# Altium project Social_Security_PRJ.PrjPcb
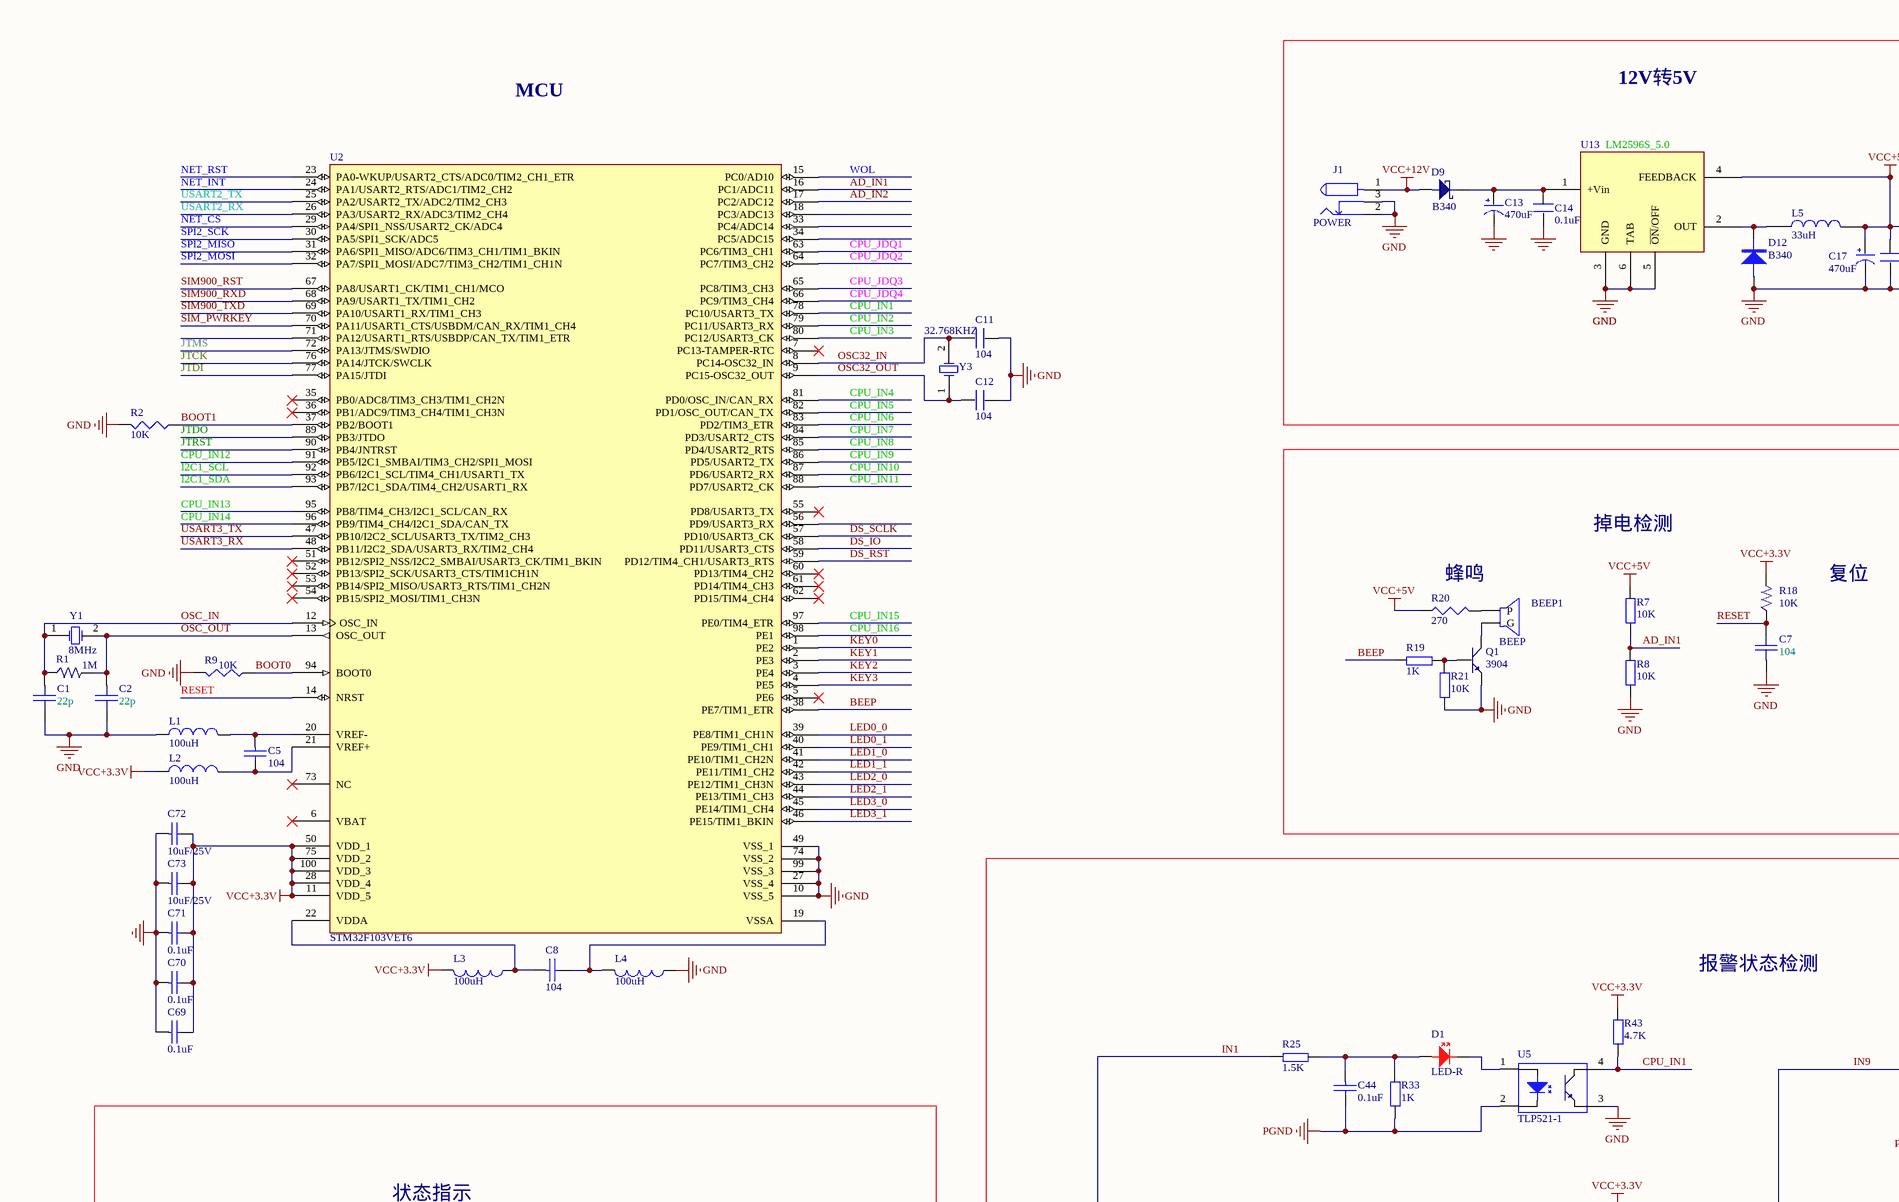
[diagram p0: Sheet1.SchDoc, top left]
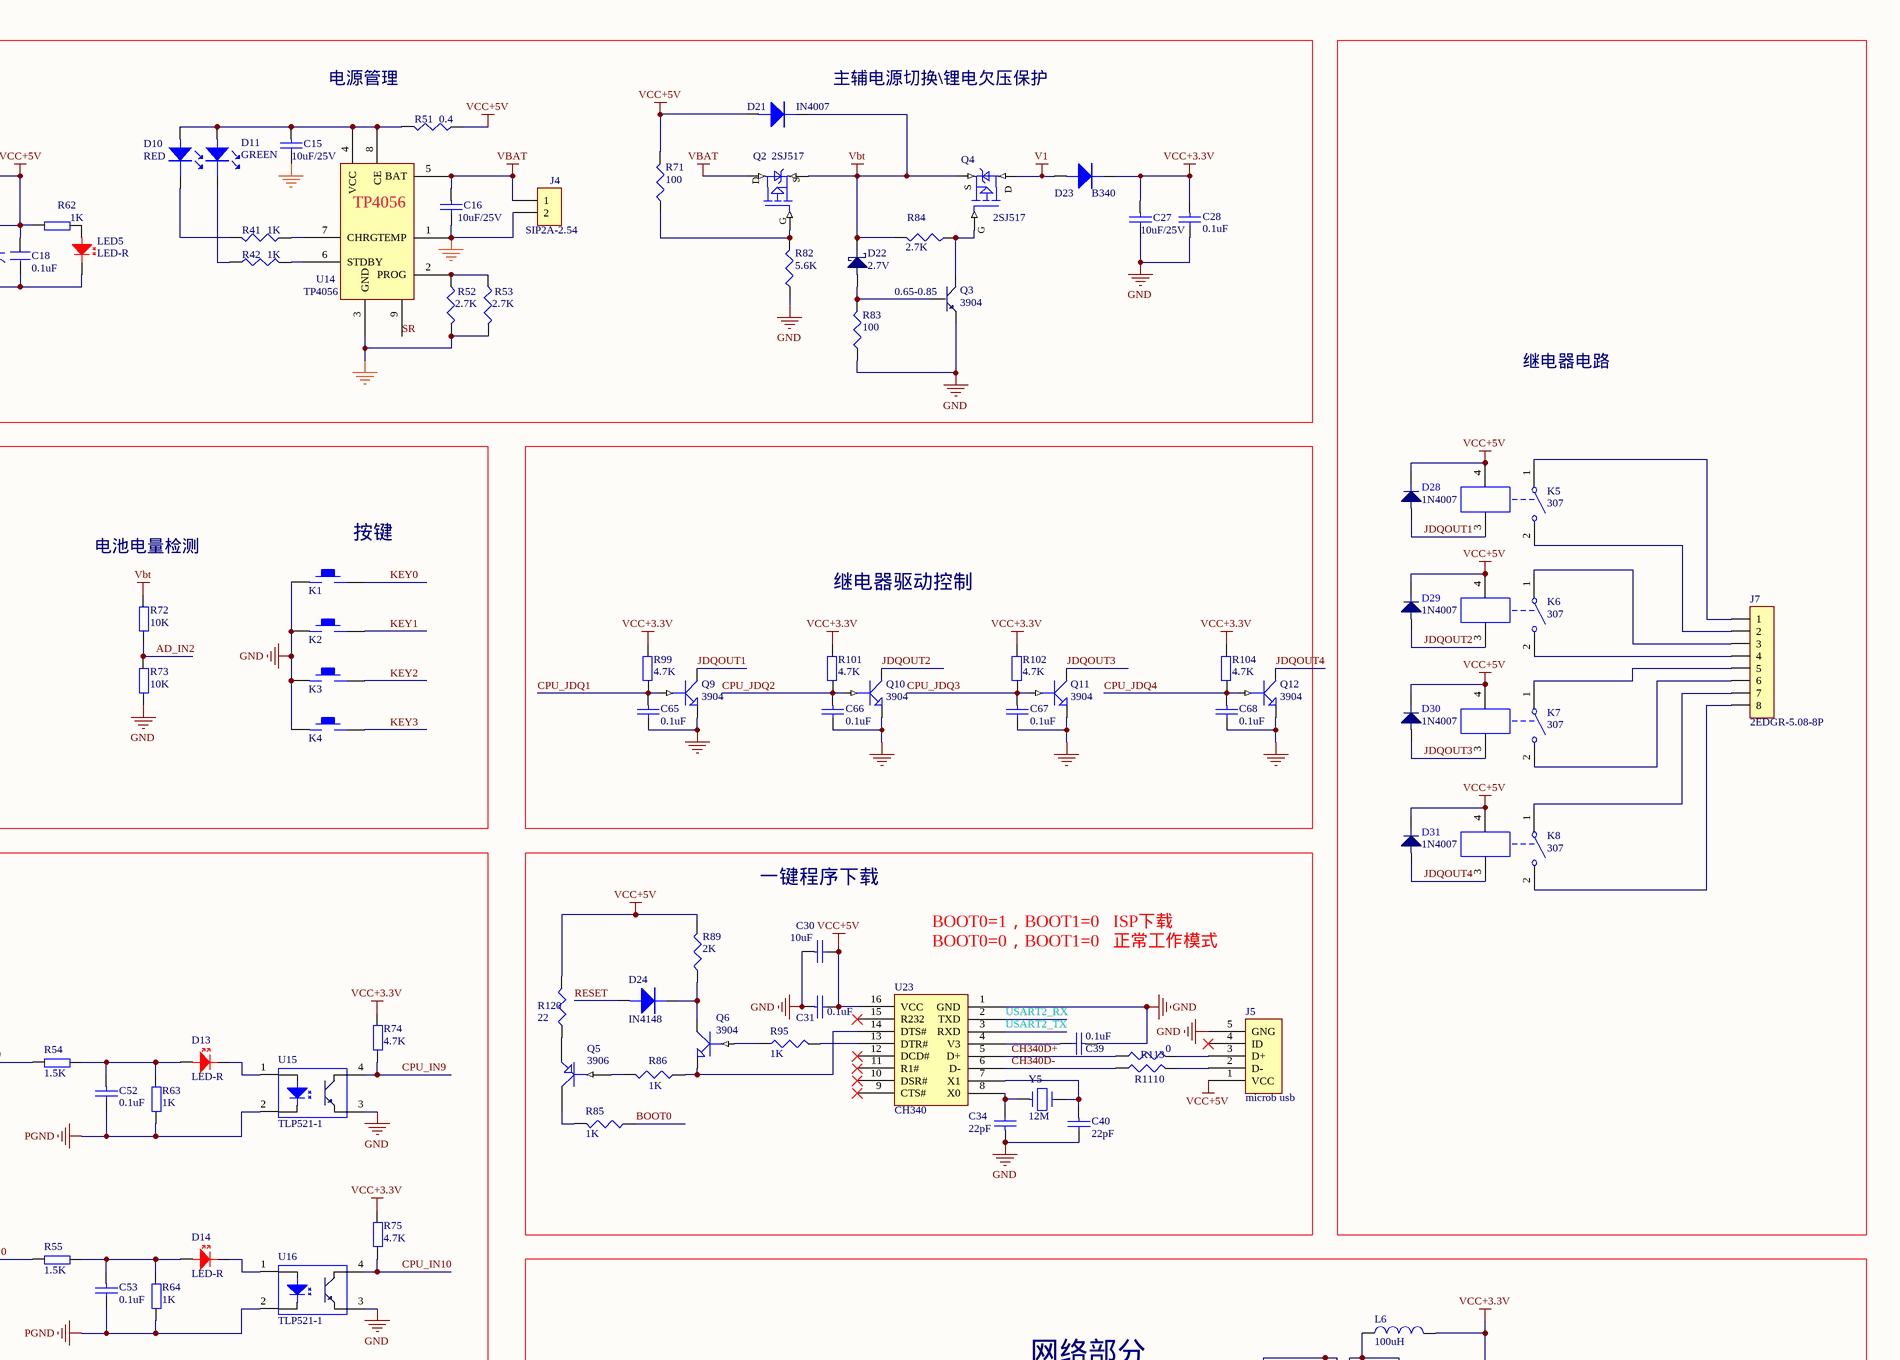
[diagram p1: Sheet1.SchDoc, top right]
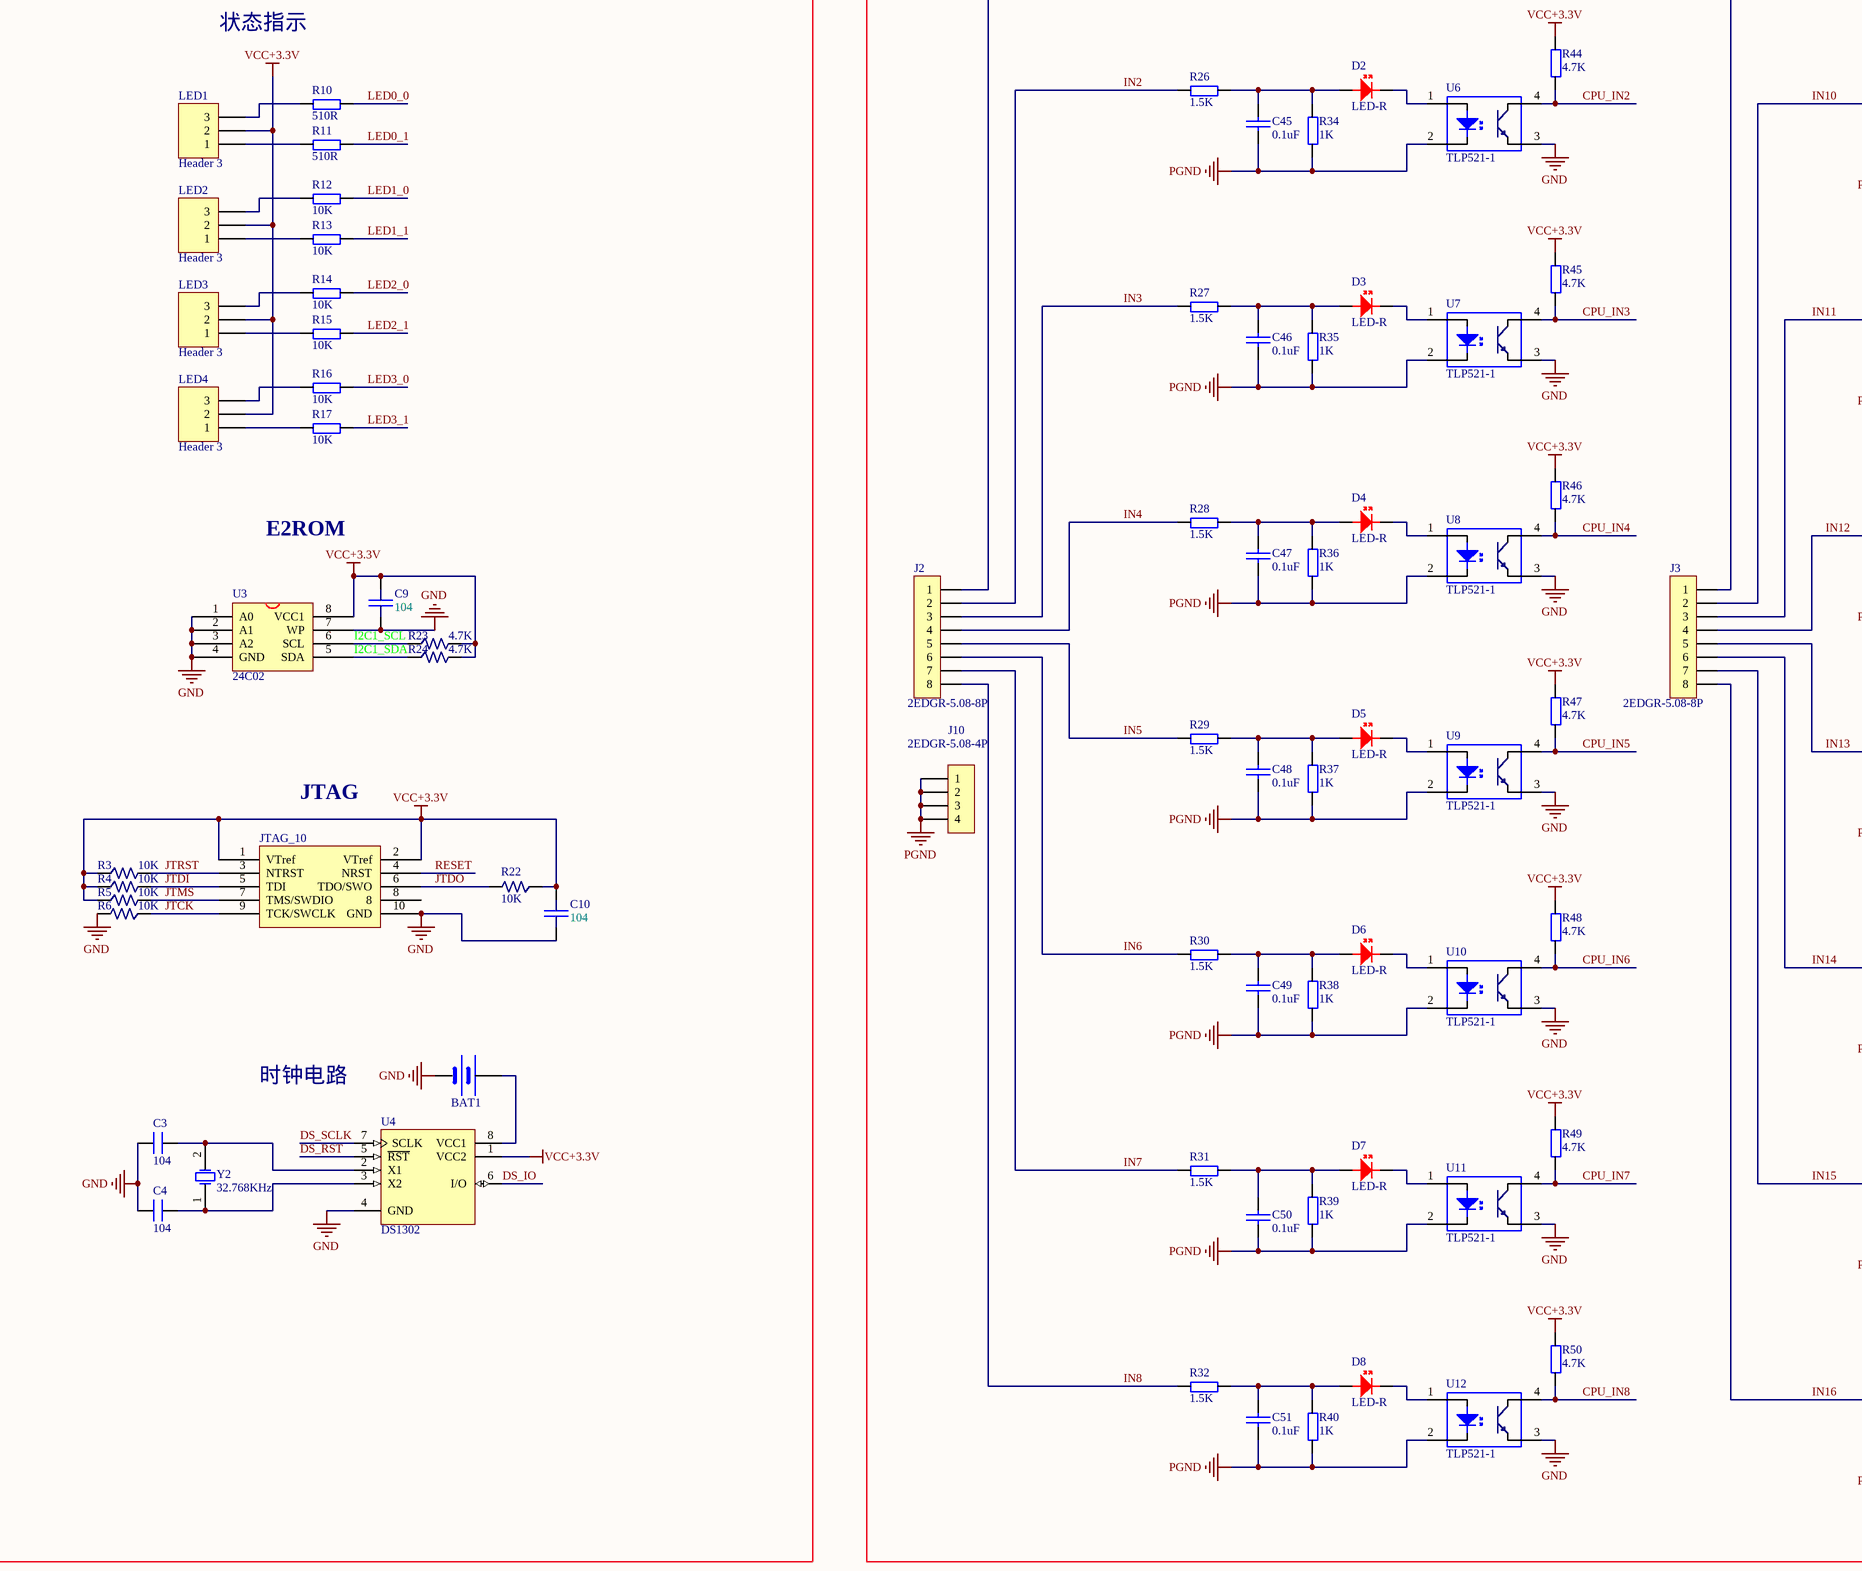
[diagram p2: Sheet1.SchDoc, bottom left]
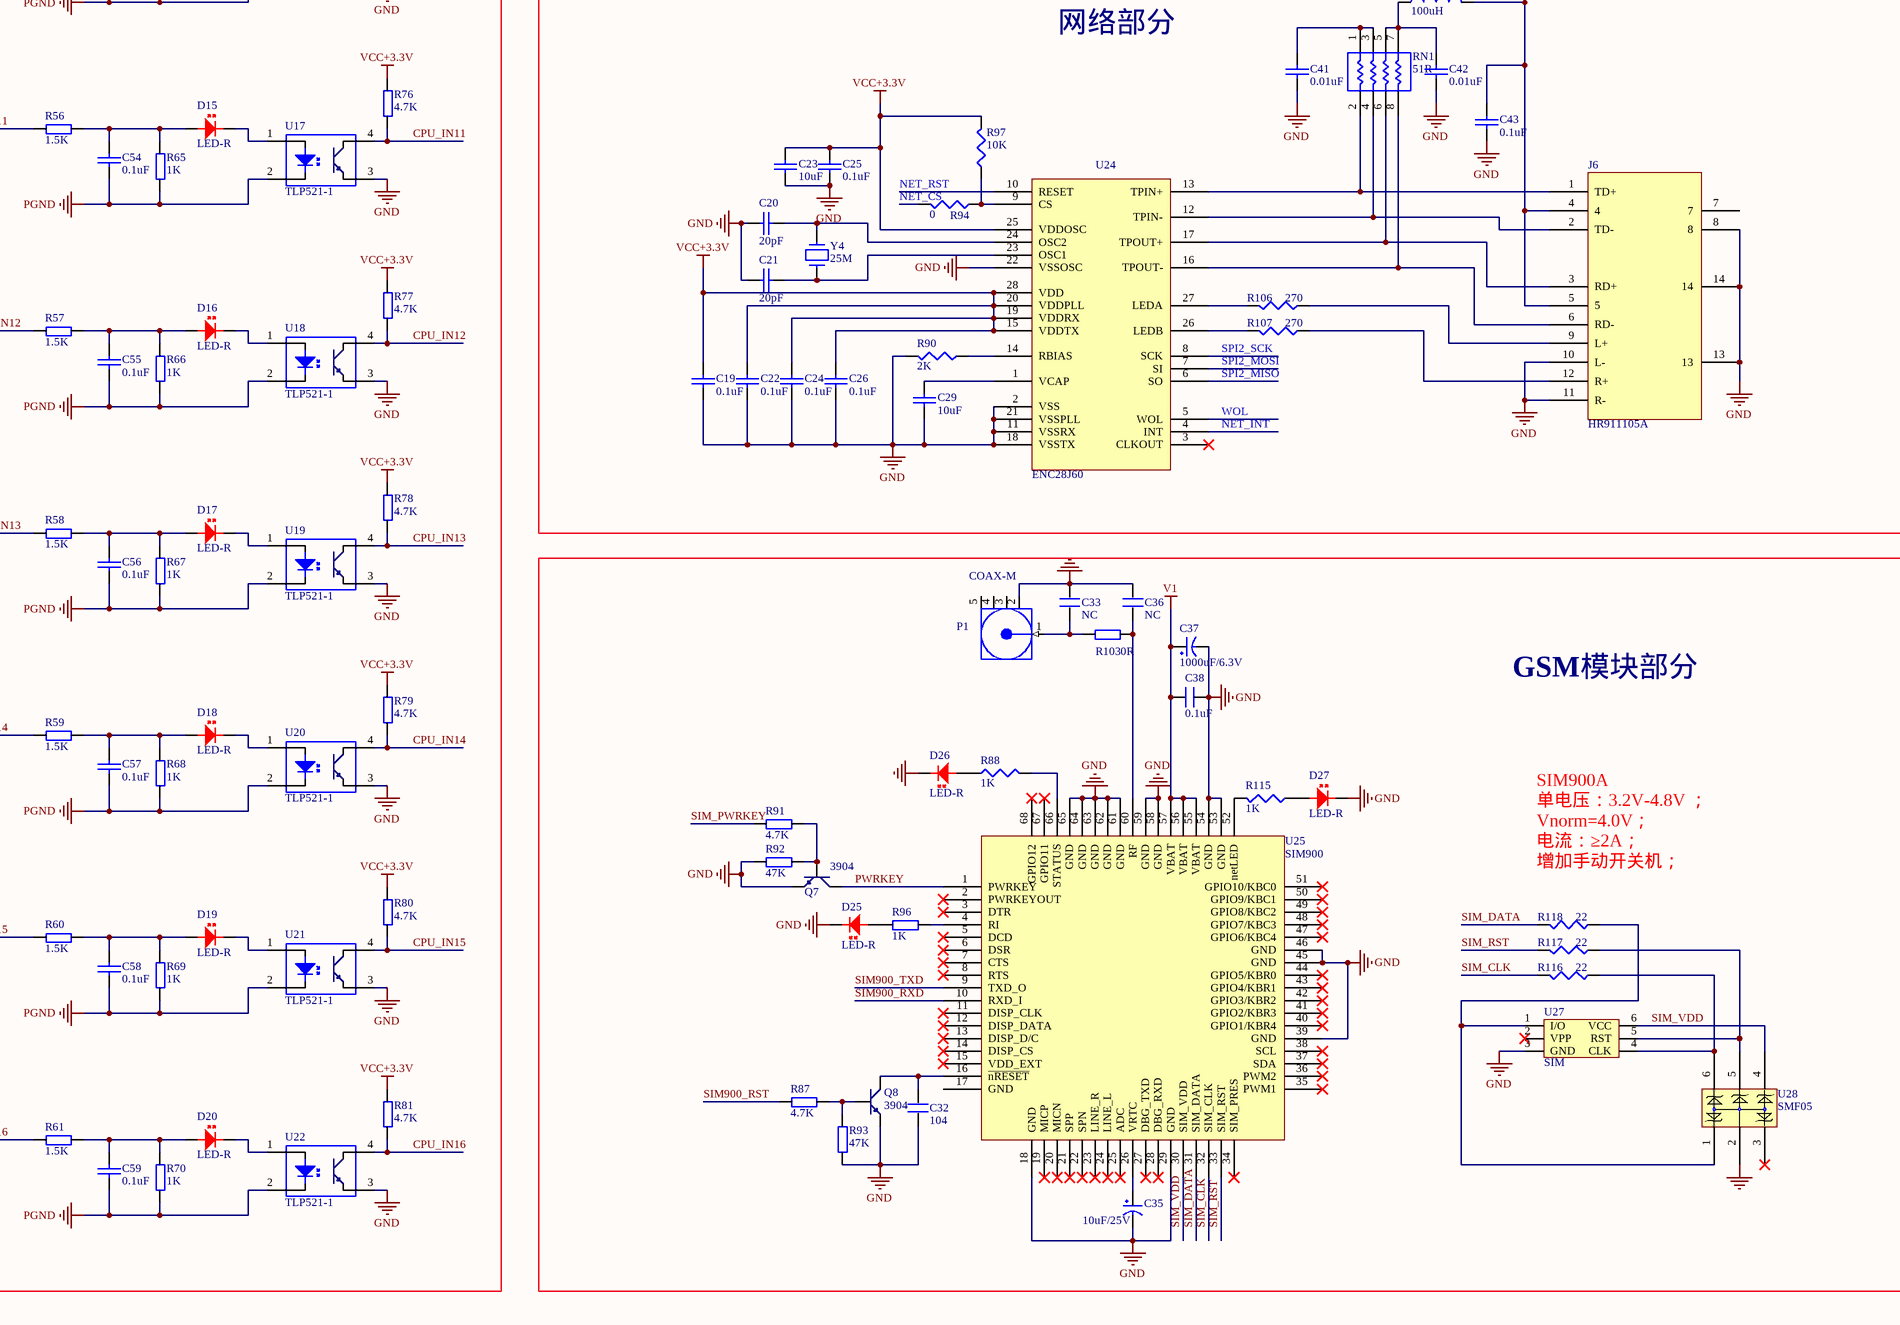
[diagram p3: Sheet1.SchDoc, bottom right]
1 sheet, 284 parts. Net scope: global (net labels, ports and power ports of the same name join across sheets).
Board file: PCB1.PcbDoc

## Sheet Sheet1.SchDoc
size A1

### Parts
BAT1  BATT  [CR2032]  (value not drawn)
BEEP1  BEEP  [BEEP-12]
C1  22p  [0805]
C2  22p  [0805]
C3  104  [0805]
C4  104  [0805]
C5  104  [0805]
C7  104  [0805]
C8  104  [0805]
C9  104  [0805]
C10  104  [0805]
C11  104  [0805]
C12  104  [0805]
C13  470uF  [RB3.5]
C14  0.1uF  [0805]
C15  10uF/25V  [0805]
C16  10uF/25V  [0805]
C17  470uF  [RB3.5]
C18  0.1uF  [0805]
C19  0.1uF  [0805]
C20  20pF  [0805]
C21  20pF  [0805]
C22  0.1uF  [0805]
C23  10uF  [0805]
C24  0.1uF  [0805]
C25  0.1uF  [0805]
C26  0.1uF  [0805]
C27  10uF/25V  [0805]
C28  0.1uF  [0805]
C29  10uF  [0805]
C30  10uF  [0805]
C31  0.1uF  [0805]
C32  104  [0805]
C33  NC  [0805]
C34  22pF  [0805]
C35  10uF/25V  [1206]
C36  NC  [0805]
C37  1000uF/6.3V  [7343]
C38  0.1uF  [0805]
C39  0.1uF  [0805]
C40  22pF  [0805]
C41  0.01uF  [0805]
C42  0.01uF  [0805]
C43  0.1uF  [0805]
C44  0.1uF  [0805]
C45  0.1uF  [0805]
C46  0.1uF  [0805]
C47  0.1uF  [0805]
C48  0.1uF  [0805]
C49  0.1uF  [0805]
C50  0.1uF  [0805]
C51  0.1uF  [0805]
C52  0.1uF  [0805]
C53  0.1uF  [0805]
C54  0.1uF  [0805]
C55  0.1uF  [0805]
C56  0.1uF  [0805]
C57  0.1uF  [0805]
C58  0.1uF  [0805]
C59  0.1uF  [0805]
C65  0.1uF  [0805]
C66  0.1uF  [0805]
C67  0.1uF  [0805]
C68  0.1uF  [0805]
C69  0.1uF  [0805]
C70  0.1uF  [0805]
C71  0.1uF  [0805]
C72  10uF/25V  [0805]
C73  10uF/25V  [0805]
D1  LED-R  [0805-LED]
D2  LED-R  [0805-LED]
D3  LED-R  [0805-LED]
D4  LED-R  [0805-LED]
D5  LED-R  [0805-LED]
D6  LED-R  [0805-LED]
D7  LED-R  [0805-LED]
D8  LED-R  [0805-LED]
D9  B340  [SMB]
D10  RED  [LED-0805]
D11  GREEN  [LED-0805]
D12  B340  [SMB]
D13  LED-R  [0805-LED]
D14  LED-R  [0805-LED]
D15  LED-R  [0805-LED]
D16  LED-R  [0805-LED]
D17  LED-R  [0805-LED]
D18  LED-R  [0805-LED]
D19  LED-R  [0805-LED]
D20  LED-R  [0805-LED]
D21  IN4007  [SMA(DO-214AC)]
D22  2.7V  [sod-123]
D23  B340  [SMB]
D24  IN4148  [SOD-23]
D25  LED-R  [LED-DIP]
D26  LED-R  [LED-DIP]
D27  LED-R  [LED-DIP]
D28  1N4007  [DO-214AC(SMA)]
D29  1N4007  [DO-214AC(SMA)]
D30  1N4007  [DO-214AC(SMA)]
D31  1N4007  [DO-214AC(SMA)]
J1  POWER  [DC10B]
J2  2EDGR-5.08-8P  [2EDGR-5.08-8P]
J3  2EDGR-5.08-8P  [2EDGR-5.08-8P]
J4  SIP2A-2.54  [2.54]
J5  microb usb  [USB_micro]
J6  HR911105A  [HR911105A]
J7  2EDGR-5.08-8P  [2EDGR-5.08-8P]
J10  2EDGR-5.08-4P  [2EDGR-5.08-4P]
JTAG_1  JTAG_10  [JTAG_10]
K1  KEY_M  [KEY_M]  (value not drawn)
K2  KEY_M  [KEY_M]  (value not drawn)
K3  KEY_M  [KEY_M]  (value not drawn)
K4  KEY_M  [KEY_M]  (value not drawn)
K5  307  [RELAY-SONGCHUAN]
K6  307  [RELAY-SONGCHUAN]
K7  307  [RELAY-SONGCHUAN]
K8  307  [RELAY-SONGCHUAN]
L1  100uH  [0805]
L2  100uH  [0805]
L3  100uH  [0805]
L4  100uH  [0805]
L5  33uH  [INDUCTOR-1212]
L6  100uH  [0805]
LED1  Header 3  [HDR1X3]
LED2  Header 3  [HDR1X3]
LED3  Header 3  [HDR1X3]
LED4  Header 3  [HDR1X3]
LED5  LED-R  [LED-0805]
P1  COAX-M  [ST-TH1]
Q1  3904  [SOT-23]
Q2  2SJ517  [SOT-89]
Q3  3904  [SOT-23]
Q4  2SJ517  [SOT-89]
Q5  3906  [SOT-23]
Q6  3904  [SOT-23]
Q7  3904  [SOT-23R]
Q8  3904  [SOT-23R]
Q9  3904  [SOT-23]
Q10  3904  [SOT-23]
Q11  3904  [SOT-23]
Q12  3904  [SOT-23]
R1  1M  [0805]
R2  10K  [0805]
R3  10K  [0805]
R4  10K  [0805]
R5  10K  [0805]
R6  10K  [0805]
R7  10K  [0805]
R8  10K  [0805]
R9  10K  [0805]
R10  510R  [0805]
R11  510R  [0805]
R12  10K  [0805]
R13  10K  [0805]
R14  10K  [0805]
R15  10K  [0805]
R16  10K  [0805]
R17  10K  [0805]
R18  10K  [0805]
R19  1K  [0805]
R20  270  [0805]
R21  10K  [0805]
R22  10K  [0805]
R23  4.7K  [0805]
R24  4.7K  [0805]
R25  1.5K  [0805]
R26  1.5K  [0805]
R27  1.5K  [0805]
R28  1.5K  [0805]
R29  1.5K  [0805]
R30  1.5K  [0805]
R31  1.5K  [0805]
R32  1.5K  [0805]
R33  1K  [0805]
R34  1K  [0805]
R35  1K  [0805]
R36  1K  [0805]
R37  1K  [0805]
R38  1K  [0805]
R39  1K  [0805]
R40  1K  [0805]
R41  1K  [0805]
R42  1K  [0805]
R43  4.7K  [0805]
R44  4.7K  [0805]
R45  4.7K  [0805]
R46  4.7K  [0805]
R47  4.7K  [0805]
R48  4.7K  [0805]
R49  4.7K  [0805]
R50  4.7K  [0805]
R51  0.4  [1206]
R52  2.7K  [0805]
R53  2.7K  [0805]
R54  1.5K  [0805]
R55  1.5K  [0805]
R56  1.5K  [0805]
R57  1.5K  [0805]
R58  1.5K  [0805]
R59  1.5K  [0805]
R60  1.5K  [0805]
R61  1.5K  [0805]
R62  1K  [0805]
R63  1K  [0805]
R64  1K  [0805]
R65  1K  [0805]
R66  1K  [0805]
R67  1K  [0805]
R68  1K  [0805]
R69  1K  [0805]
R70  1K  [0805]
R71  100  [0805]
R72  10K  [0805]
R73  10K  [0805]
R74  4.7K  [0805]
R75  4.7K  [0805]
R76  4.7K  [0805]
R77  4.7K  [0805]
R78  4.7K  [0805]
R79  4.7K  [0805]
R80  4.7K  [0805]
R81  4.7K  [0805]
R82  5.6K  [0805]
R83  100  [0805]
R84  2.7K  [0805]
R85  1K  [0805]
R86  1K  [0805]
R87  4.7K  [0805]
R88  1K  [0805]
R89  2K  [0805]
R90  2K  [0805]
R91  4.7K  [0805]
R92  47K  [0805]
R93  47K  [0805]
R94  0  [0805]
R95  1K  [0805]
R96  1K  [0805]
R97  10K  [0805]
R99  4.7K  [0805]
R101  4.7K  [0805]
R102  4.7K  [0805]
R103  0R  [0603]
R104  4.7K  [0805]
R106  270  [0805]
R107  270  [0805]
R111  0  [0805]
R113  0  [0805]
R115  1K  [0805]
R116  22  [0805]
R117  22  [0805]
R118  22  [0805]
R120  22  [0805]
RN1  51R  [0603-4]
U2  STM32F103VET6  [LQFP100_N]
U3  24C02  [SOP-8]
U4  DS1302  [SOP-8]
U5  TLP521-1  [DIP4]
U6  TLP521-1  [DIP4]
U7  TLP521-1  [DIP4]
U8  TLP521-1  [DIP4]
U9  TLP521-1  [DIP4]
U10  TLP521-1  [DIP4]
U11  TLP521-1  [DIP4]
U12  TLP521-1  [DIP4]
U13  LM2596S_5.0  [TO-263-5]
U14  TP4056  [SO8E]
U15  TLP521-1  [DIP4]
U16  TLP521-1  [DIP4]
U17  TLP521-1  [DIP4]
U18  TLP521-1  [DIP4]
U19  TLP521-1  [DIP4]
U20  TLP521-1  [DIP4]
U21  TLP521-1  [DIP4]
U22  TLP521-1  [DIP4]
U23  CH340  [SOP16]
U24  ENC28J60  [ssop28]
U25  SIM900  [SIM-900]
U27  SIM  [sim-6p]
U28  SMF05  [SC70-6L]
Y1  8MHz  [XTAL_US]
Y2  32.768KHz  [cs-308]
Y3  32.768KHZ  [CS-308]
Y4  25M  [XTAL_US]
Y5  12M  [XTAL_US]

### Blocks framed on the sheet
12V转5V: C13-C18 C27 C28 D9-D12 D21-D23 J1 J4 L5 LED5 Q2-Q4 R41 R42 R51-R53 R62 R71 R82-R84 U13 U14
继电器电路: D28-D31 J7 K5-K8
继电器驱动控制: C65-C68 Q9-Q12 R99 R101 R102 R104
报警状态检测: C44-C59 D1-D8 D13-D20 J2 J3 J10 R25-R40 R43-R50 R54-R61 R63-R70 R74-R81 U5-U12 U15-U22
一键程序下载: C30 C31 C34 C39 C40 D24 J5 Q5 Q6 R85 R86 R89 R95 R111 R113 R120 U23 Y5
网络部分: C19-C26 C29 C41-C43 J6 L6 R90 R94 R97 R106 R107 RN1 U24 Y4
GSM模块部分: C32 C33 C35-C38 D25-D27 P1 Q7 Q8 R87 R88 R91-R93 R96 R103 R115-R118 U25 U27 U28

### Nets
GND: BAT1.2(GND) C1.2 C2.2 C3.1 C4.1 C7.1 C9.2 C10.2 C11.1 C12.1 C13.2(GND) C14.1 C15.2 C16.2 C17.2(GND) C18.1 C19.2 C20.1 C21.1 C22.2 C23.1 C24.2 C25.2 C26.2 C27.2 C28.2 C29.2 C30.1 C31.1 C32.1 C33.2 C34.1 C35.2(GND) C36.2 C37.2(GND) C38.2 C39.1 C40.2 C41.2 C42.2 C43.2 C65.2 C66.2 C67.2 C68.2 C69.1 C70.1 C71.1 C72.1 C73.1 D12.1(A) D25.2 D26.2 D27.2 J1.2 J1.3 J4.2 J5.5(GNG) J6.8 J6.10(L-) J6.11(R-) J6.13 J6.14 JTAG_1.10(GND) K1.1 K2.1 K3.1 K4.1 L1.1 L4.1 LED5.2 P1.2(GND) Q1.1(E) Q3.1(E) Q7.1(E) Q8.1(E) Q9.2(E) Q10.2(E) Q11.2(E) Q12.2(E) R2.2 R6.2 R8.1 R9.2 R21.1 R52.2 R53.2 R73.1 R82.1 R83.1 R90.2 R92.1 R93.1 U2.10(VSS_5) U2.27(VSS_4) U2.49(VSS_1) U2.74(VSS_2) U2.99(VSS_3) U3.1(A0) U3.2(A1) U3.3(A2) U3.4(GND) U3.7(WP) U4.4(GND) U5.3 U6.3 U7.3 U8.3 U9.3 U10.3 U11.3 U12.3 U13.3(GND) U13.5(~{ON}/OFF) U13.6(TAB) U14.1(TEMP) U14.3(GND) U15.3 U16.3 U17.3 U18.3 U19.3 U20.3 U21.3 U22.3 U23.1(GND) U24.2(VSS) U24.11(VSSRX) U24.18(VSSTX) U24.21(VSSPLL) U24.22(VSSOSC) U25.18(GND) U25.29(GND) U25.39(GND) U25.45(GND) U25.46(GND) U25.53(GND) U25.54(GND) U25.58(GND) U25.59(GND) U25.61(GND) U25.62(GND) U25.63(GND) U25.64(GND) U25.65(GND) U27.3(GND) U28.2
PGND: C44.2 C45.2 C46.2 C47.2 C48.2 C49.2 C50.2 C51.2 C52.2 C53.2 C54.2 C55.2 C56.2 C57.2 C58.2 C59.2 J10.1 J10.2 J10.3 J10.4 R33.1 R34.1 R35.1 R36.1 R37.1 R38.1 R39.1 R40.1 R63.1 R64.1 R65.1 R66.1 R67.1 R68.1 R69.1 R70.1 U5.2 U6.2 U7.2 U8.2 U9.2 U10.2 U11.2 U12.2 U15.2 U16.2 U17.2 U18.2 U19.2 U20.2 U21.2 U22.2
V1: C37.1(VCC) C38.1 D23.1(A) Q4.2(D) U25.55(VBAT) U25.56(VBAT) U25.57(VBAT)
VBAT: C16.1 J4.1 Q2.2(D) U14.5(BAT)
Vbt: D21.2(K) D22.2 Q2.3(S) Q4.3(S) R72.2 R84.2
VCC+3.3V: C9.1 C10.1 C19.1 C22.1 C23.2 C24.1 C25.1 C26.1 C27.1 C28.1 C43.1 C69.2 C70.2 C71.2 C72.2 C73.2 D23.2(K) J6.4 J6.5 JTAG_1.1(VTref) JTAG_1.2(VTref) L2.1 L3.2 L6.2 LED1.2 LED2.2 LED3.2 LED4.2 R3.1 R4.1 R5.1 R18.2 R22.1 R23.2 R24.2 R43.2 R44.2 R45.2 R46.2 R47.2 R48.2 R49.2 R50.2 R74.2 R75.2 R76.2 R77.2 R78.2 R79.2 R80.2 R81.2 R97.2 R99.1 R101.1 R102.1 R104.1 U2.11(VDD_5) U2.28(VDD_4) U2.50(VDD_1) U2.75(VDD_2) U2.100(VDD_3) U3.8(VCC1) U4.1(VCC2) U24.15(VDDTX) U24.19(VDDRX) U24.20(VDDPLL) U24.25(VDDOSC) U24.28(VDD)
VCC+5V: C17.1(VCC) C18.2 C30.2 C31.2 D21.1(A) D28.2 D29.2 D30.2 D31.2 J5.1(VCC) K5.4 K6.4 K7.4 K8.4 L5.2 R7.2 R20.1 R51.1 R62.1 R71.2 R89.2 R120.2 U13.4(FEEDBACK) U23.16(VCC)
VCC+12V: D9.1 J1.1
AD_IN1: R7.1 R8.2 U2.16(PC1/ADC11)
AD_IN2: R72.1 R73.2 U2.17(PC2/ADC12)
BEEP: R19.1 U2.38(PE7/TIM1_ETR)
BOOT0: R9.1 R85.1 U2.94(BOOT0)
BOOT1: R2.1 U2.37(PB2/BOOT1)
CH340D+: R113.1 U23.5(D+)
CH340D-: R111.1 U23.6(D-)
CPU_IN1: R43.1 U2.78(PC10/USART3_TX) U5.4
CPU_IN2: R44.1 U2.79(PC11/USART3_RX) U6.4
CPU_IN3: R45.1 U2.80(PC12/USART3_CK) U7.4
CPU_IN4: R46.1 U2.81(PD0/OSC_IN/CAN_RX) U8.4
CPU_IN5: R47.1 U2.82(PD1/OSC_OUT/CAN_TX) U9.4
CPU_IN6: R48.1 U2.83(PD2/TIM3_ETR) U10.4
CPU_IN7: R49.1 U2.84(PD3/USART2_CTS) U11.4
CPU_IN8: R50.1 U2.85(PD4/USART2_RTS) U12.4
CPU_IN9: R74.1 U2.86(PD5/USART2_TX) U15.4
CPU_IN10: R75.1 U2.87(PD6/USART2_RX) U16.4
CPU_IN11: R76.1 U2.88(PD7/USART2_CK) U17.4
CPU_IN12: R77.1 U2.91(PB5/I2C1_SMBAI/TIM3_CH2/SPI1_MOSI) U18.4
CPU_IN13: R78.1 U2.95(PB8/TIM4_CH3/I2C1_SCL/CAN_RX) U19.4
CPU_IN14: R79.1 U2.96(PB9/TIM4_CH4/I2C1_SDA/CAN_TX) U20.4
CPU_IN15: R80.1 U2.97(PE0/TIM4_ETR) U21.4
CPU_IN16: R81.1 U2.98(PE1) U22.4
CPU_JDQ1: C65.1 Q9.1(B) R99.2 U2.63(PC6/TIM3_CH1)
CPU_JDQ2: C66.1 Q10.1(B) R101.2 U2.64(PC7/TIM3_CH2)
CPU_JDQ3: C67.1 Q11.1(B) R102.2 U2.65(PC8/TIM3_CH3)
CPU_JDQ4: C68.1 Q12.1(B) R104.2 U2.66(PC9/TIM3_CH4)
DS_IO: U2.58(PD11/USART3_CTS) U4.6(I/O)
DS_RST: U2.59(PD12/TIM4_CH1/USART3_RTS) U4.5(~{RST})
DS_SCLK: U2.57(PD10/USART3_CK) U4.7(SCLK)
I2C1_SCL: R23.1 U2.92(PB6/I2C1_SCL/TIM4_CH1/USART1_TX) U3.6(SCL)
I2C1_SDA: R24.1 U2.93(PB7/I2C1_SDA/TIM4_CH2/USART1_RX) U3.5(SDA)
IN1: J2.1 R25.1
IN2: J2.2 R26.1
IN3: J2.3 R27.1
IN4: J2.4 R28.1
IN5: J2.5 R29.1
IN6: J2.6 R30.1
IN7: J2.7 R31.1
IN8: J2.8 R32.1
IN9: J3.1 R54.1
IN10: J3.2 R55.1
IN11: J3.3 R56.1
IN12: J3.4 R57.1
IN13: J3.5 R58.1
IN14: J3.6 R59.1
IN15: J3.7 R60.1
IN16: J3.8 R61.1
JDQOUT1: D28.1 K5.3 Q9.3(C)
JDQOUT2: D29.1 K6.3 Q10.3(C)
JDQOUT3: D30.1 K7.3 Q11.3(C)
JDQOUT4: D31.1 K8.3 Q12.3(C)
JTCK: JTAG_1.9(TCK/SWCLK) R6.1 U2.76(PA14/JTCK/SWCLK)
JTDI: JTAG_1.5(TDI) R4.2 U2.77(PA15/JTDI)
JTDO: JTAG_1.6(TDO/SWO) R22.2 U2.89(PB3/JTDO)
JTMS: JTAG_1.7(TMS/SWDIO) R5.2 U2.72(PA13/JTMS/SWDIO)
JTRST: JTAG_1.3(NTRST) R3.2 U2.90(PB4/JNTRST)
KEY0: K1.2 U2.1(PE2)
KEY1: K2.2 U2.2(PE3)
KEY2: K3.2 U2.3(PE4)
KEY3: K4.2 U2.4(PE5)
LED0_0: R10.2 U2.39(PE8/TIM1_CH1N)
LED0_1: R11.2 U2.40(PE9/TIM1_CH1)
LED1_0: R12.2 U2.41(PE10/TIM1_CH2N)
LED1_1: R13.2 U2.42(PE11/TIM1_CH2)
LED2_0: R14.2 U2.43(PE12/TIM1_CH3N)
LED2_1: R15.2 U2.44(PE13/TIM1_CH3)
LED3_0: R16.2 U2.45(PE14/TIM1_CH4)
LED3_1: R17.2 U2.46(PE15/TIM1_BKIN)
NET_CS: R94.2 U2.29(PA4/SPI1_NSS/USART2_CK/ADC4)
NET_INT: U2.24(PA1/USART2_RTS/ADC1/TIM2_CH2) U24.4(INT)
NET_RST: U2.23(PA0-WKUP/USART2_CTS/ADC0/TIM2_CH1_ETR) U24.10(RESET)
OSC32_IN: C11.2 U2.8(PC14-OSC32_IN) Y3.2(OSC2)
OSC32_OUT: C12.2 U2.9(PC15-OSC32_OUT) Y3.1(OSC1)
OSC_IN: C1.1 R1.1 U2.12(OSC_IN) Y1.1(OSC1)
OSC_OUT: C2.1 R1.2 U2.13(OSC_OUT) Y1.2(OSC2)
PWRKEY: Q7.3(C) U25.1(PWRKEY)
RESET: C7.2 D24.1(A) JTAG_1.4(NRST) R18.1 U2.14(NRST)
SIM900_RST: R87.1 U2.67(PA8/USART1_CK/TIM1_CH1/MCO)
SIM900_RXD: U2.68(PA9/USART1_TX/TIM1_CH2) U25.10(RXD_I)
SIM900_TXD: U2.69(PA10/USART1_RX/TIM1_CH3) U25.9(TXD_O)
SIM_CLK: R116.2 U25.32(SIM_CLK)
SIM_DATA: R118.2 U25.31(SIM_DATA)
SIM_PWRKEY: R91.1 U2.70(PA11/USART1_CTS/USBDM/CAN_RX/TIM1_CH4)
SIM_RST: R117.2 U25.33(SIM_RST)
SIM_VDD: U25.30(SIM_VDD) U27.6(VCC) U28.4
SPI2_MISO: U2.31(PA6/SPI1_MISO/ADC6/TIM3_CH1/TIM1_BKIN) U24.6(SO)
SPI2_MOSI: U2.32(PA7/SPI1_MOSI/ADC7/TIM3_CH2/TIM1_CH1N) U24.7(SI)
SPI2_SCK: U2.30(PA5/SPI1_SCK/ADC5) U24.8(SCK)
SR: U14.9
USART2_RX: U2.26(PA3/USART2_RX/ADC3/TIM2_CH4) U23.2(TXD)
USART2_TX: U2.25(PA2/USART2_TX/ADC2/TIM2_CH3) U23.3(RXD)
USART3_RX: U2.48(PB11/I2C2_SDA/USART3_RX/TIM2_CH4)
USART3_TX: U2.47(PB10/I2C2_SCL/USART3_TX/TIM2_CH3)
WOL: U2.15(PC0/AD10) U24.5(WOL)
NetBAT1_1: BAT1.1(VCC) U4.8(VCC1)
NetBEEP1_1: BEEP1.1(P) R20.2
NetBEEP1_2: BEEP1.2(G) Q1.3(C)
NetC3_2: C3.2 U4.2(X1) Y2.2(OSC2)
NetC4_2: C4.2 U4.3(X2) Y2.1(OSC1)
NetC5_1: C5.1 L1.2 U2.20(VREF-)
NetC5_2: C5.2 L2.2 U2.21(VREF+)
NetC8_1: C8.1 L3.1 U2.22(VDDA)
NetC8_2: C8.2 L4.2 U2.19(VSSA)
NetC13_1: C13.1(VCC) C14.2 D9.2 U13.1(+Vin)
NetC15_1: C15.1 D10.1 D11.1 R51.2 U14.4(VCC) U14.8(CE)
NetC20_2: C20.2 U24.24(OSC2) Y4.2
NetC21_2: C21.2 U24.23(OSC1) Y4.1
NetC29_1: C29.1 U24.1(VCAP)
NetC32_2: C32.2 Q8.3(C) U25.16(~{nRESET})
NetC33_1: C33.1 P1.1(Signal) R103.1
NetC34_2: C34.2 U23.8(X0) Y5.1
NetC35_1: C35.1(VCC) U25.26(VRTC)
NetC36_1: C36.1 R103.2 U25.60(RF)
NetC39_2: C39.2 U23.4(V3)
NetC40_1: C40.1 U23.7(X1) Y5.2
NetC41_1: C41.1 RN1.1 RN1.3
NetC42_1: C42.1 L6.1 RN1.5 RN1.7
NetC44_1: C44.1 D1.1 R25.2 R33.2
NetC45_1: C45.1 D2.1 R26.2 R34.2
NetC46_1: C46.1 D3.1 R27.2 R35.2
NetC47_1: C47.1 D4.1 R28.2 R36.2
NetC48_1: C48.1 D5.1 R29.2 R37.2
NetC49_1: C49.1 D6.1 R30.2 R38.2
NetC50_1: C50.1 D7.1 R31.2 R39.2
NetC51_1: C51.1 D8.1 R32.2 R40.2
NetC52_1: C52.1 D13.1 R54.2 R63.2
NetC53_1: C53.1 D14.1 R55.2 R64.2
NetC54_1: C54.1 D15.1 R56.2 R65.2
NetC55_1: C55.1 D16.1 R57.2 R66.2
NetC56_1: C56.1 D17.1 R58.2 R67.2
NetC57_1: C57.1 D18.1 R59.2 R68.2
NetC58_1: C58.1 D19.1 R60.2 R69.2
NetC59_1: C59.1 D20.1 R61.2 R70.2
NetD1_2: D1.2 U5.1
NetD2_2: D2.2 U6.1
NetD3_2: D3.2 U7.1
NetD4_2: D4.2 U8.1
NetD5_2: D5.2 U9.1
NetD6_2: D6.2 U10.1
NetD7_2: D7.2 U11.1
NetD8_2: D8.2 U12.1
NetD10_2: D10.2 R41.2
NetD11_2: D11.2 R42.1
NetD12_2: D12.2(K) L5.1 U13.2(OUT)
NetD13_2: D13.2 U15.1
NetD14_2: D14.2 U16.1
NetD15_2: D15.2 U17.1
NetD16_2: D16.2 U18.1
NetD17_2: D17.2 U19.1
NetD18_2: D18.2 U20.1
NetD19_2: D19.2 U21.1
NetD20_2: D20.2 U22.1
NetD22_1: D22.1 Q3.2(B) R83.2
NetD24_2: D24.2(K) Q6.3(C) R89.1
NetD25_1: D25.1 R96.1
NetD26_1: D26.1 R88.1
NetD27_1: D27.1 R115.1
NetJ5_2: J5.2(D-) R111.2
NetJ5_3: J5.3(D+) R113.2
NetJ6_1: J6.1(TD+) RN1.2 U24.13(TPIN+)
NetJ6_2: J6.2(TD-) RN1.4 U24.12(TPIN-)
NetJ6_3: J6.3(RD+) RN1.6 U24.17(TPOUT+)
NetJ6_6: J6.6(RD-) RN1.8 U24.16(TPOUT-)
NetJ6_9: J6.9(L+) R106.1
NetJ6_12: J6.12(R+) R107.1
NetJ7_1: J7.1 K5.1
NetJ7_2: J7.2 K5.2
NetJ7_3: J7.3 K6.1
NetJ7_4: J7.4 K6.2
NetJ7_5: J7.5 K7.1
NetJ7_6: J7.6 K7.2
NetJ7_7: J7.7 K8.1
NetJ7_8: J7.8 K8.2
NetLED1_1: LED1.1 R11.1
NetLED1_3: LED1.3 R10.1
NetLED2_1: LED2.1 R13.1
NetLED2_3: LED2.3 R12.1
NetLED3_1: LED3.1 R15.1
NetLED3_3: LED3.3 R14.1
NetLED4_1: LED4.1 R17.1
NetLED4_3: LED4.3 R16.1
NetLED5_1: LED5.1 R62.2
NetQ1_2: Q1.2(B) R19.2 R21.2
NetQ2_1: Q2.1(G) R71.1 R82.2
NetQ3_3: Q3.3(C) Q4.1(G) R84.1
NetQ5_1: Q5.1(B) R86.2
NetQ5_2: Q5.2(E) R120.1
NetQ5_3: Q5.3(C) R85.2
NetQ6_1: Q6.1(B) R95.1
NetQ6_2: Q6.2(E) R86.1 U23.14(DTS#)
NetQ7_2: Q7.2(B) R91.2 R92.2
NetQ8_2: Q8.2(B) R87.2 R93.2
NetR41_1: R41.1 U14.7(CHRG)
NetR42_2: R42.2 U14.6(STDBY)
NetR52_1: R52.1 R53.1 U14.2(PROG)
NetR88_2: R88.2 U25.66(STATUS)
NetR90_1: R90.1 U24.14(RBIAS)
NetR94_1: R94.1 R97.1 U24.9(CS)
NetR95_2: R95.2 U23.13(DTR#)
NetR96_2: R96.2 U25.4(RI)
NetR106_2: R106.2 U24.27(LEDA)
NetR107_2: R107.2 U24.26(LEDB)
NetR115_2: R115.2 U25.52(netLED)
NetR116_1: R116.1 U27.4(CLK) U28.6
NetR117_1: R117.1 U27.5(RST) U28.5
NetR118_1: R118.1 U27.1(I/O) U28.1

Not connected (* = marked no-connect by the designer): J5 4(ID)*; J6 7; JTAG_1 8; P1 3(GND) 4(GND) 5(GND); U2 5(PE6)* 6(VBAT)* 7(PC13-TAMPER-RTC)* 18(PC3/ADC13) 33(PC4/ADC14) 34(PC5/ADC15) 35(PB0/ADC8/TIM3_CH3/TIM1_CH2N)* 36(PB1/ADC9/TIM3_CH4/TIM1_CH3N)* 51(PB12/SPI2_NSS/I2C2_SMBAI/USART3_CK/TIM1_BKIN)* 52(PB13/SPI2_SCK/USART3_CTS/TIM1CH1N)* 53(PB14/SPI2_MISO/USART3_RTS/TIM1_CH2N)* 54(PB15/SPI2_MOSI/TIM1_CH3N)* 55(PD8/USART3_TX)* 56(PD9/USART3_RX) 60(PD13/TIM4_CH2)* 61(PD14/TIM4_CH3)* 62(PD15/TIM4_CH4)* 71(PA12/USART1_RTS/USBDP/CAN_TX/TIM1_ETR) 73(NC)*; U23 9(CTS#)* 10(DSR#)* 11(R1#)* 12(DCD#)* 15(R232)*; U24 3(CLKOUT)*; U25 2(PWRKEYOUT)* 3(DTR)* 5(DCD)* 6(DSR)* 7(CTS)* 8(RTS)* 11(DISP_CLK)* 12(DISP_DATA)* 13(DISP_D/C)* 14(DISP_CS)* 15(VDD_EXT)* 17(GND) 19(MICP)* 20(MICN)* 21(SPP)* 22(SPN)* 23(LINE_R)* 24(LINE_L)* 25(ADC)* 27(DBG_TXD)* 28(DBG_RXD)* 34(SIM_PRES)* 35(PWM1)* 36(PWM2)* 37(SDA)* 38(SCL)* 40(GPIO1/KBR4)* 41(GPIO2/KBR3)* 42(GPIO3/KBR2)* 43(GPIO4/KBR1)* 44(GPIO5/KBR0)* 47(GPIO6/KBC4)* 48(GPIO7/KBC3)* 49(GPIO8/KBC2)* 50(GPIO9/KBC1)* 51(GPIO10/KBC0)* 67(GPIO11)* 68(GPIO12)*; U27 2(VPP)*; U28 3*

### Notes on the sheet
- MCU
- 电源管理
- (near D21) 主辅电源切换\锂电欠压保护
- (near Q3) 0.65-0.85
- 掉电检测
- (near K1) 按键
- (near R20) 蜂鸣
- 复位
- 电池电量检测
- BOOT0=1，BOOT1=0   ISP下载
  BOOT0=0，BOOT1=0   正常工作模式
- 状态指示
- E2ROM
- JTAG
- 时钟电路
- (near R118) SIM900A
  单电压：3.2V-4.8V ；
  Vnorm=4.0V；
  电流：≥2A；
  增加手动开关机；

### Library data of the parts
BAT1 = BAT
C1 C2 C7 C9 C10 = CAP: 陶瓷电容
C3 C4 C11 C12 C14 C18 C32 C33 C36 C38 = C
C5 C8 C13 C15-C17 C19-C22 C24-C29 C31 C35 C37 C39 C41-C59 C65-C73 = CAP
C23 C30 C34 C40 = CAP: 0.1uF
D1-D8 D13-D20 D25-D27 LED5 = LED-RED: 红色LED
D9 = 1N5824(SS54): 肖特基二极管
D10 D11 = LED
D12 D21 D23 D24 = DIODE
D22 = 1N5824(SS54): 3V稳压管
D28-D31 = 1N4007: 1A整流二极管
J1 = POW
J2 J3 J7 = 2EDGR-5.08-8P: 端子
J4 = SIP2A-2.50（带槽）
J10 = SIP4A-2.50(带槽)
K5-K8 = JDQ_307: 继电器
L1-L6 = INDUCTOR
LED1-LED4 = Header 3: Header, 3-Pin; LatestRevisionDate: 17-Jul-2002; LatestRevisionNote: Re-released for DXP Platform.; Publisher: Altium Limited
P1 = COAX-M: SMA-J-P-H-ST-TH1; PackageDocument: Rev. A, 16-Jun-1997; PCB_Layout: Complies with manufacturer's recommendation.; DrillSize: Corresponds to nominal value.; Published: 15-Jul-2004; LatestRevisionDate: 15-Jul-2004; LatestRevisionNote: Component Replaced.; DatasheetDocument: 30-May-2003; PackageReference: 908-21103; Publisher: Altium Limited; ComponentLink1Description: Manufacturer Link; ComponentLink1URL: http://www.amphenolrf.com/
Q1 Q3 Q7 Q8 = NPN: 8050/BCW846/BCW847
Q2 Q4 = MOSFET P_1
Q5 = PNP1
Q6 Q9-Q12 = NPN1
R1 R3-R6 R18 R22-R24 = RES-1%: 高精度电阻
R2 R9 R20 R41 R42 R51-R53 R85 R86 R88-R90 R94 R95 R97 R106 R107 R111 R113 R115-R118 R120 = RES1
R7 R8 R10-R17 R25-R40 R43-R50 R54-R70 R72-R81 R87 R91-R93 R96 R99 R101-R104 = Res
R19 R21 = R
R71 R82-R84 = RESISTOR
RN1 = RESPACK
U2 = STM32F103VET6: STM32 ARM-based 32-bit MCU with 64 Kbytes Flash, 100-pin LQFP, Industrial Temperature; Published: 30-May-2008; DatasheetVersion: rev6, Mar-2008; PackageVersion: Mar-2008; PackageReference: LQFP100; Publisher: Altium Limited; PackageDescription: 100-Pin Low-Profile Quad Flat Pack, 14 x 14 mm Body, 0.5 mm Pitch (LQFP100); ComponentLink1Description: Manufacturer Link; ComponentLink1URL: www.st.com/stm32; ComponentLink2Description: Datasheet; ComponentLink2URL: http://www.st.com/stonline/products/literature/ds/13587.pdf
U3 = 24C256
U4 = DS1302: 实时时钟
U5-U12 U15-U22 = TLP521: 光耦
U13 = LM2596S_5.0: 3A开关电源芯片
U27 = SIM: 手机SIM卡
Y1-Y3 = XTAL: Crystal Oscillator; Published: 8-Jun-2000; LatestRevisionDate: 17-Jul-2002; LatestRevisionNote: Re-released for DXP Platform.; Publisher: Altium Limited
Y4 Y5 = CRYSTAL